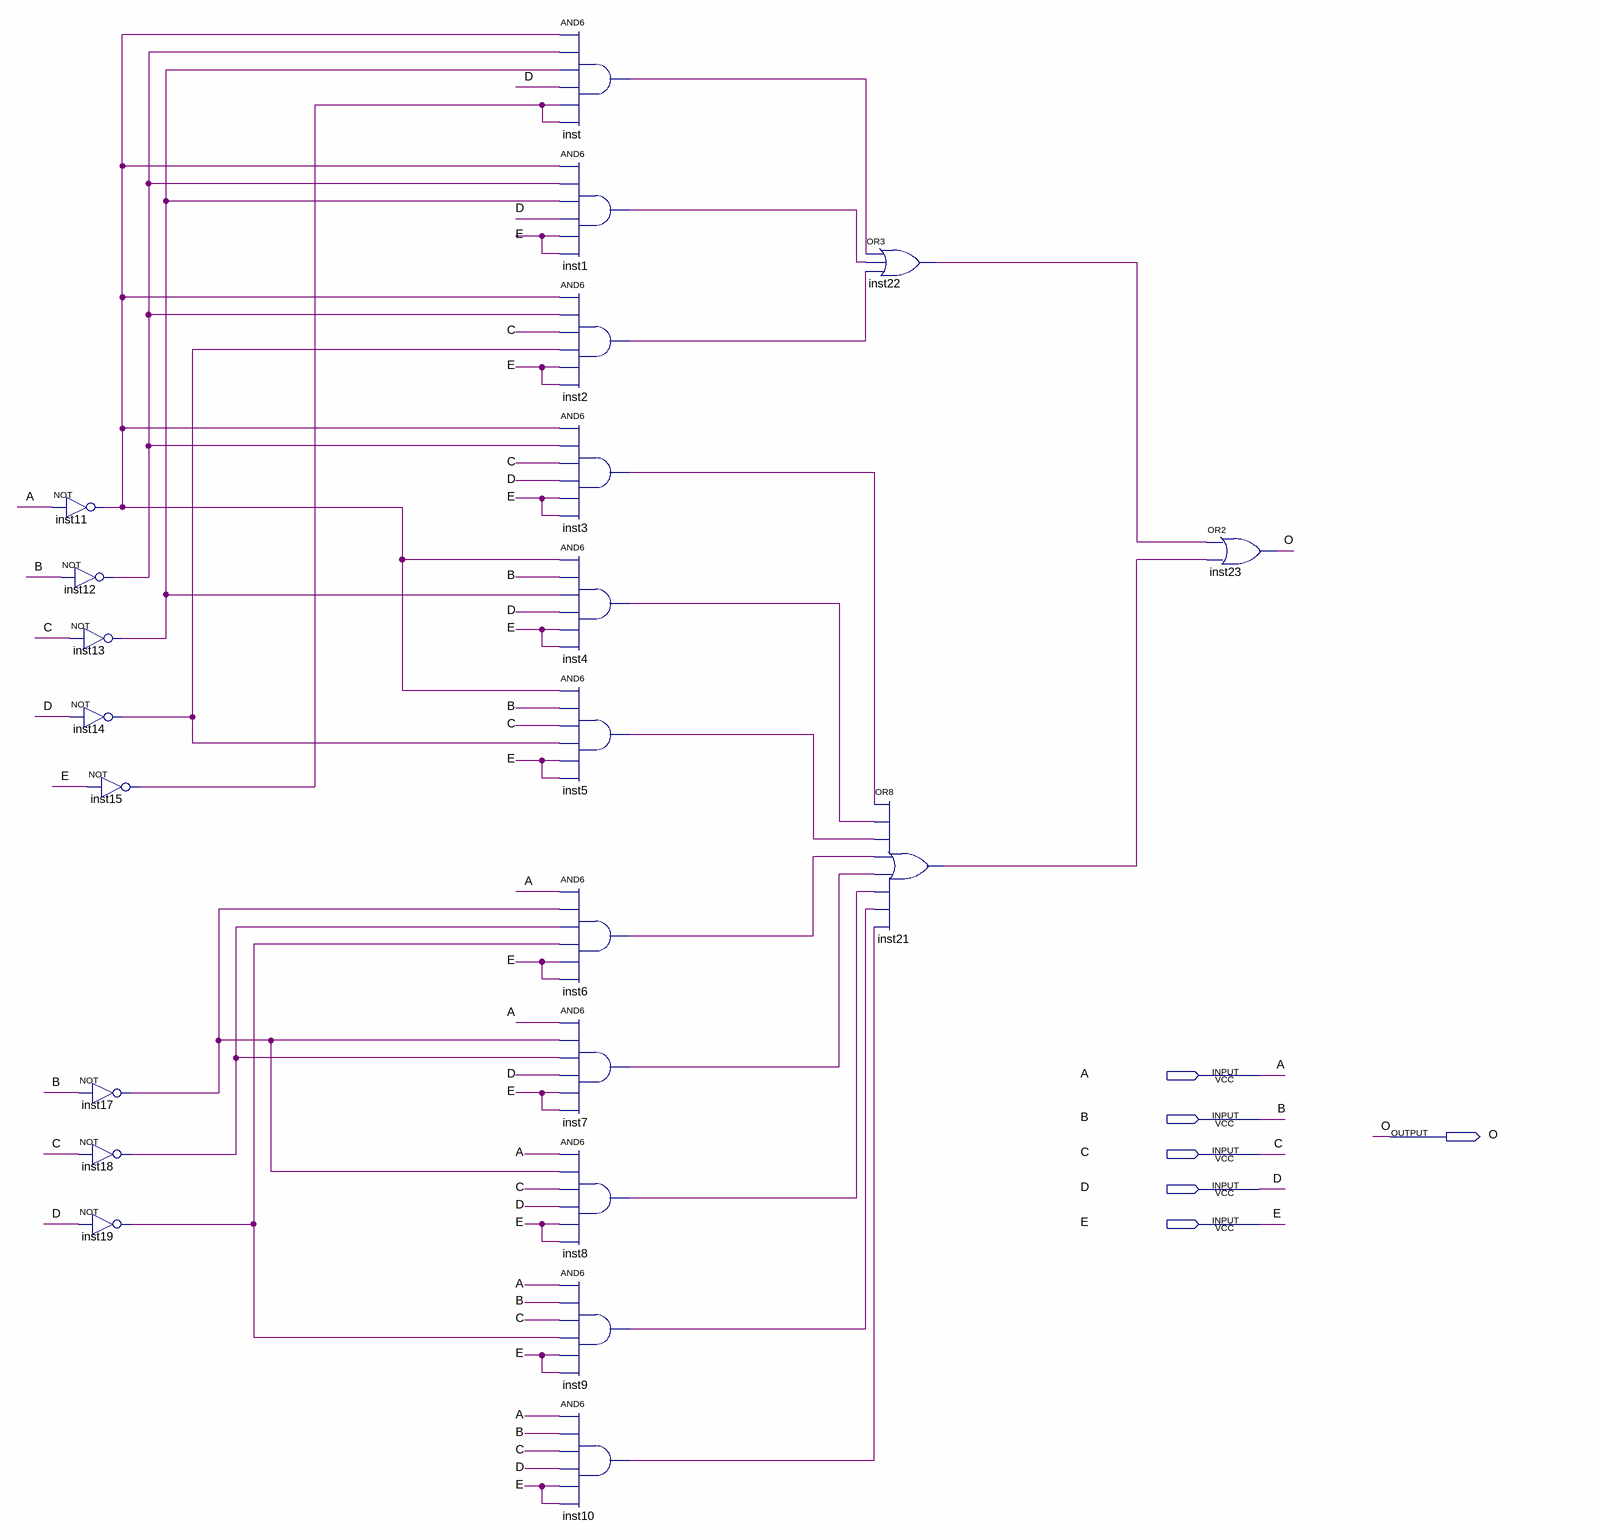
[diagram p0: schematic sheet]
// Quartus schematic prime_extension.bdf as structural Verilog: 22 symbols, 6 pins
module prime_extension (
  input  A,
  input  B,
  input  C,
  input  D,
  input  E,
  output O
);

  wire inst1_out, inst2_out, inst3_out, inst4_out, inst5_out, inst6_out, inst7_out, inst8_out, inst9_out,
       inst10_out, inst11_out, inst12_out, inst13_out, inst14_out, inst15_out, inst17_out, inst18_out,
       inst19_out, inst21_out, inst22_out, inst_out;

  not inst11 (inst11_out, A);
  not inst12 (inst12_out, B);
  not inst13 (inst13_out, C);
  not inst14 (inst14_out, D);
  not inst17 (inst17_out, B);
  not inst18 (inst18_out, C);
  not inst19 (inst19_out, D);
  not inst15 (inst15_out, E);
  and inst (inst_out, inst11_out, inst12_out, inst13_out, D, inst15_out, inst15_out);
  and inst1 (inst1_out, inst11_out, inst12_out, inst13_out, D, E, E);
  and inst2 (inst2_out, inst11_out, inst12_out, C, inst14_out, E, E);
  and inst3 (inst3_out, inst11_out, inst12_out, C, D, E, E);
  and inst4 (inst4_out, inst11_out, B, inst13_out, D, E, E);
  and inst5 (inst5_out, inst11_out, B, C, inst14_out, E, E);
  and inst6 (inst6_out, A, inst17_out, inst18_out, inst19_out, E, E);
  and inst7 (inst7_out, A, inst17_out, inst18_out, D, E, E);
  and inst8 (inst8_out, A, inst17_out, C, D, E, E);
  and inst9 (inst9_out, A, B, C, inst19_out, E, E);
  and inst10 (inst10_out, A, B, C, D, E, E);
  or inst22 (inst22_out, inst_out, inst1_out, inst2_out);
  or inst21 (inst21_out, inst3_out, inst4_out, inst5_out, inst6_out, inst7_out, inst8_out, inst9_out, inst10_out);
  or inst23 (O, inst22_out, inst21_out);
endmodule
